# EAGLE schematic MainBoard (EAGLE 9.3.0)
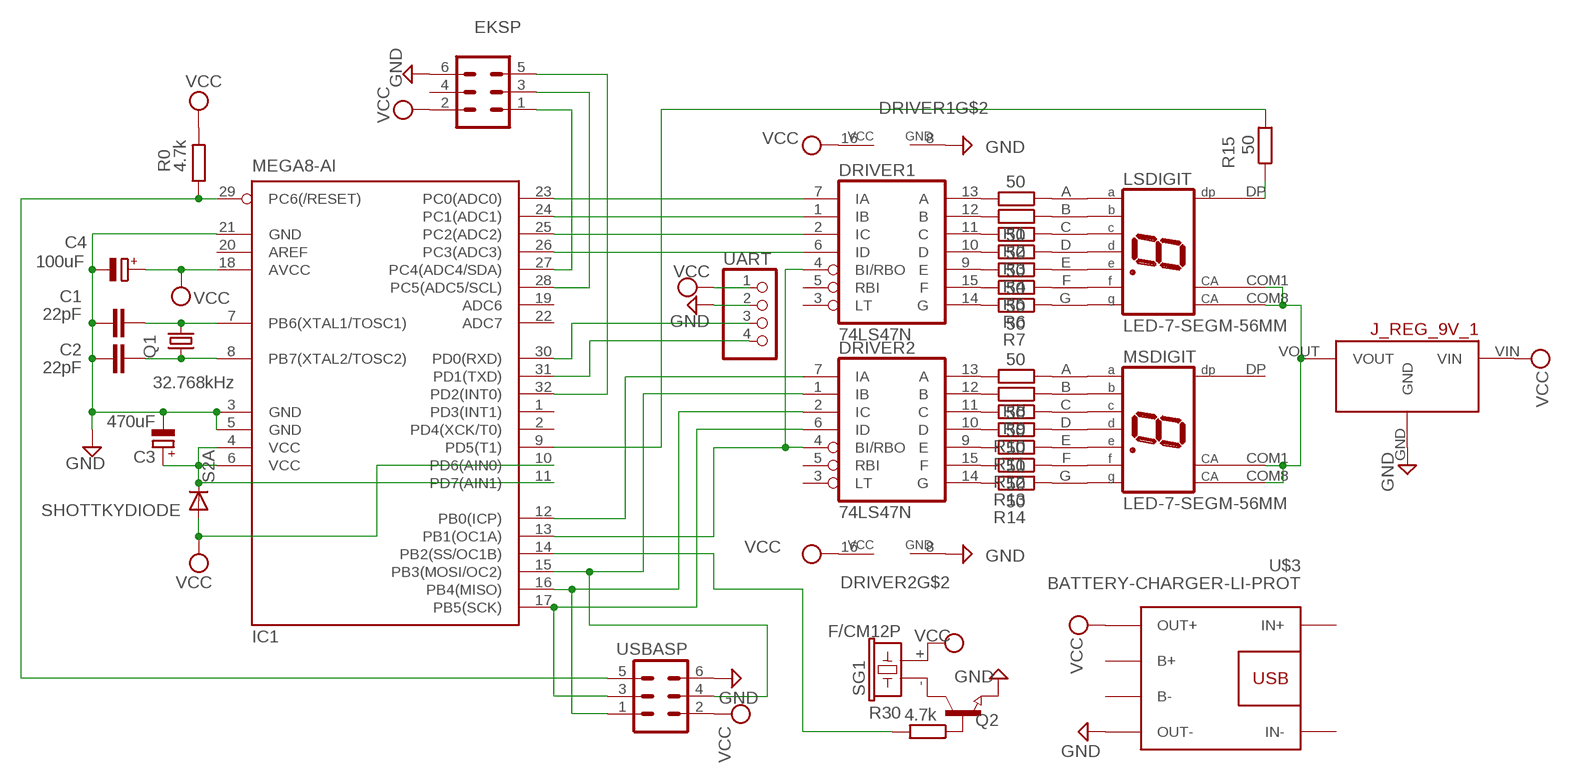
[diagram p0: schematic, sheet 1]

## Parts
C1  22pF  C2.5/2  [C2.5-2]
C2  22pF  C2.5/2  [C2.5-2]
C3  470uF  CPOL-EU140CLH-1010  [140CLH-1010]
C4  100uF  CPOL-EU140CLH-1010  [140CLH-1010]
DRIVER1  74LS47N  [DIL16]
DRIVER2  74LS47N  [DIL16]
EKSP  ML6  [ML6]
IC1  MEGA8-AI  [TQFP32-08]
J_REG_9V_1  9V_VOLTAGE_REGULATOR  [9V_VOLTAGE_REGULATOR]
LSDIGIT  LED-7-SEGM-56MM  [MYTHT]
MSDIGIT  LED-7-SEGM-56MM  [MYTHT]
Q1  32.768kHz  CRYSTALTC26V  [TC26V]
Q2  NPN-TRANSISTOR_SOT23  [SOT23]
R0  4.7k  R-EU_01005  [R01005]
R1  50  R-EU_01005  [R01005]
R2  50  R-EU_01005  [R01005]
R3  50  R-EU_01005  [R01005]
R4  50  R-EU_01005  [R01005]
R5  50  R-EU_01005  [R01005]
R6  50  R-EU_01005  [R01005]
R7  50  R-EU_01005  [R01005]
R8  50  R-EU_01005  [R01005]
R9  50  R-EU_01005  [R01005]
R10  50  R-EU_01005  [R01005]
R11  50  R-EU_01005  [R01005]
R12  50  R-EU_01005  [R01005]
R13  50  R-EU_01005  [R01005]
R14  50  R-EU_01005  [R01005]
R15  50  R-EU_01005  [R01005]
R30  4.7k  R-EU_01005  [R01005]
SG1  F/CM12P  [F/CM12P]
SHOTTKYDIODE  S2A  [DO214AA]
U$3  BATTERY-CHARGER-LI-PROT  [BATTERY-CHARGER-LI-PROT]
UART  PINHD-1X4  [1X04]
USBASP  ML6  [ML6]

## Nets
GND: C1.1 C2.1 C3.- C4.- DRIVER1.8(GND) DRIVER2.8(GND) EKSP.6 IC1.3(GND) IC1.5(GND) IC1.21(GND) J_REG_9V_1.GND Q2.2(E) U$3.OUT- UART.2 USBASP.6
N$1: C1.2 IC1.7(PB6(XTAL1/TOSC1)) Q1.2
N$2: C2.2 IC1.8(PB7(XTAL2/TOSC2)) Q1.1
N$3: DRIVER2.7(IA) IC1.12(PB0(ICP))
N$4: DRIVER1.4(BI/RBO) DRIVER2.4(BI/RBO) IC1.13(PB1(OC1A))
N$5: DRIVER1.13(A) R1.2
N$6: DRIVER1.12(B) R2.2
N$7: DRIVER1.11(C) R3.2
N$8: DRIVER1.10(D) R4.2
N$9: DRIVER1.9(E) R5.2
N$10: DRIVER1.15(F) R6.2
N$11: DRIVER1.14(G) R7.2
N$12: EKSP.1 IC1.27(PC4(ADC4/SDA))
N$13: LSDIGIT.A R1.1
N$14: EKSP.5 IC1.32(PD2(INT0))
N$15: LSDIGIT.B R2.1
N$16: LSDIGIT.C R3.1
N$17: LSDIGIT.D R4.1
N$18: LSDIGIT.E R5.1
N$19: LSDIGIT.F R6.1
N$20: EKSP.3 IC1.28(PC5(ADC5/SCL))
N$21: DRIVER2.6(ID) IC1.17(PB5(SCK)) USBASP.3
N$22: IC1.29(PC6(/RESET)) R0.1 USBASP.5
N$23: DRIVER2.1(IB) IC1.15(PB3(MOSI/OC2)) USBASP.4
N$24: DRIVER2.2(IC) IC1.16(PB4(MISO)) USBASP.1
N$25: LSDIGIT.G R7.1
N$26: DRIVER1.7(IA) IC1.23(PC0(ADC0))
N$27: DRIVER1.1(IB) IC1.24(PC1(ADC1))
N$28: DRIVER1.2(IC) IC1.25(PC2(ADC2))
N$29: DRIVER1.6(ID) IC1.26(PC3(ADC3))
N$30: IC1.31(PD1(TXD)) UART.4
N$31: IC1.30(PD0(RXD)) UART.3
N$32: LSDIGIT.DP R15.1
N$33: IC1.9(PD5(T1)) R15.2
N$34: MSDIGIT.A R8.1
N$35: C3.+ IC1.4(VCC) IC1.6(VCC) IC1.11(PD7(AIN1)) SHOTTKYDIODE.C
N$36: J_REG_9V_1.VOUT LSDIGIT.COM1(CA1) LSDIGIT.COM8(CA8) MSDIGIT.COM1(CA1) MSDIGIT.COM8(CA8)
N$37: MSDIGIT.B R9.1
N$38: MSDIGIT.C R10.1
N$39: MSDIGIT.D R11.1
N$40: MSDIGIT.E R12.1
N$41: MSDIGIT.F R13.1
N$42: MSDIGIT.G R14.1
N$43: IC1.14(PB2(SS/OC1B)) R30.2
N$44: DRIVER2.14(G) R14.2
N$45: DRIVER2.15(F) R13.2
N$46: DRIVER2.9(E) R12.2
N$47: DRIVER2.10(D) R11.2
N$48: DRIVER2.11(C) R10.2
N$49: DRIVER2.12(B) R9.2
N$50: DRIVER2.13(A) R8.2
N$51: Q2.1(B) R30.1
N$52: Q2.3(C) SG1.-
VCC: C4.+ DRIVER1.16(VCC) DRIVER2.16(VCC) EKSP.2 IC1.10(PD6(AIN0)) IC1.18(AVCC) J_REG_9V_1.VIN R0.2 SG1.+ SHOTTKYDIODE.A U$3.OUT+ UART.1 USBASP.2
Unconnected: DRIVER1.3(LT) DRIVER1.5(RBI) DRIVER2.3(LT) DRIVER2.5(RBI) EKSP.4 IC1.1(PD3(INT1)) IC1.2(PD4(XCK/T0)) IC1.19(ADC6) IC1.20(AREF) IC1.22(ADC7) MSDIGIT.DP U$3.B+ U$3.B- U$3.IN+ U$3.IN-

## Library data of the parts
C1 C2 = capacitor-wima:C: CAPACITOR naming: grid - package width
C3 C4 = rcl:CPOL-EU: POLARIZED CAPACITOR, European symbol; SPICEPREFIX: C
DRIVER1 DRIVER2 = 74xx-eu:74*47: BCD to seven segment DECODER/DRIVER Source: http://www.ee.washington.edu/stores/DataSheets/74ls/74ls47.pdf
EKSP USBASP = con-harting-ml:ML6: HARTING; OC_FARNELL: unknown; OC_NEWARK: unknown
IC1 = atmel:MEGA8: MICROCONTROLLER 8 Kbytes FLASH, 1 kbytes SRAM, 512 bytes EEPROM, USART, 6-channel 10 bit ADC, 2-channel 8 bit ADC Pin compatible with Atmega48, ATMega88, ATMega168 Source: avr.lbr; MPN: ATMEGA8-16AU; OC_FARNELL: 9171371; OC_NEWARK: 73M8863
J_REG_9V_1 = PololuVreg:9V_VOLTAGE_REGULATOR: Polulu 9V Step-Up Voltage Regulator U3V12F9
LSDIGIT MSDIGIT = BigLED7Segm:LED-7-SEGM-56MM
Q1 = crystal:CRYSTAL: CRYSTAL; OC_FARNELL: unknown; OC_NEWARK: unknown
Q2 = semicon-smd-ipc:NPN-TRANSISTOR_: NPN TRANSISTOR
R0 R1-R15 R30 = rcl:R-EU_: RESISTOR, European symbol; SPICEPREFIX: R
SG1 = buzzer:F/CM12P: BUZZER Source: Buerklin; OC_FARNELL: unknown; OC_NEWARK: unknown
SHOTTKYDIODE = s2x_10:S2*: S2A - S2M General Purpose Rectifiers Source: http://www.fairchildsemi.com/datasheets/S2/S2A.pdf; MF: Fairchild; MPN: S2A; OC_FARNELL: 1467485; OC_NEWARK: 58K2391
U$3 = diy-modules:BATTERY-CHARGER-LI-PROT: Lithium Battery 5V Charger with protection circuit More details available here: http://www.instructables.com/id/DIY-Lithium-ion-Battery-Charger/step4/TP4056-based-lithium-ion-battery-charger-module/ Click here to find device on ebay.com <http://www.ebay.com/sch/tp4056+charger+usb+protection>
UART = pinhead:PINHD-1X4: PIN HEADER